# Altium schematic sheet SH10-ASSI.SchDoc
size A4
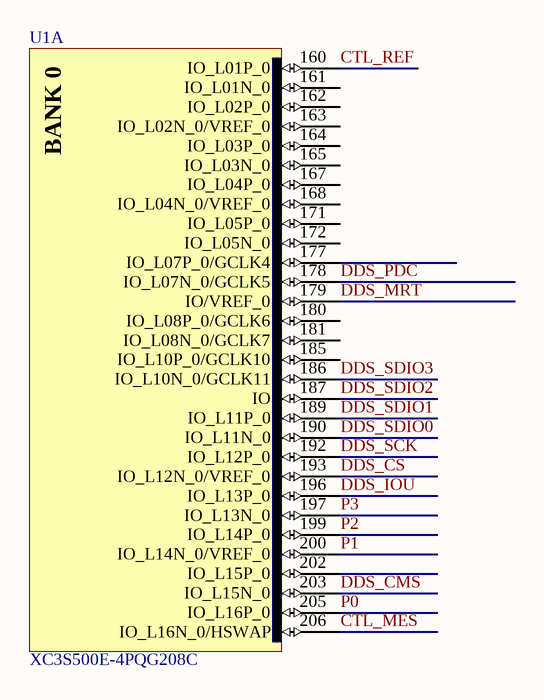
[diagram p0: SH10-ASSI.SchDoc]

## Parts
U1  XC3S500E-4PQG208C  [PQG208_N]  (part A of 8)

## Nets
CTL_MES: U1.206(IO_L16N_0/HSWAP)
CTL_REF: U1.160(IO_L01P_0)
DDS_~{CS}: U1.193(IO_L12N_0/VREF_0)
DDS_CMS: U1.203(IO_L15N_0)
DDS_IOU: U1.196(IO_L13P_0)
DDS_MRT: U1.179(IO/VREF_0)
DDS_PDC: U1.178(IO_L07N_0/GCLK5)
DDS_SCK: U1.192(IO_L12P_0)
DDS_SDIO0: U1.190(IO_L11N_0)
DDS_SDIO1: U1.189(IO_L11P_0)
DDS_SDIO2: U1.187(IO)
DDS_SDIO3: U1.186(IO_L10N_0/GCLK11)
P0: U1.205(IO_L16P_0)
P1: U1.200(IO_L14N_0/VREF_0)
P2: U1.199(IO_L14P_0)
P3: U1.197(IO_L13N_0)

Not connected (* = marked no-connect by the designer): U1 161(IO_L01N_0) 162(IO_L02P_0) 163(IO_L02N_0/VREF_0) 164(IO_L03P_0) 165(IO_L03N_0) 167(IO_L04P_0) 168(IO_L04N_0/VREF_0) 171(IO_L05P_0) 172(IO_L05N_0) 177(IO_L07P_0/GCLK4) 180(IO_L08P_0/GCLK6) 181(IO_L08N_0/GCLK7) 185(IO_L10P_0/GCLK10) 202(IO_L15P_0)

## Notes on the sheet
- (in symbol XC3S500E-4PQG208C, part A) BANK 0

## Library data of the parts
U1 = XC3S500E-4PQG208C: Spartan-3E 1.2V FPGA, 158 User I/Os, 208-Pin Pb-Free PQFP, Standard Performance, Commercial Grade; Published: 6-Jun-2005; LatestRevisionDate: 13-Apr-2006; LatestRevisionNote: IPC-7351 Footprint Added.; DatasheetVersion: 16-Mar-2007; PackageVersion: ver1.2, Jun-2004; PackageReference: PQG208; Publisher: Altium Limited; PackageDescription: 208-Pin Plastic Quad Flat Pack (PQG208) - Pb-Free; Code_JEDEC: MS-029-FA-1; ComponentLink1Description: Manufacturer Link; ComponentLink1URL: http://www.xilinx.com/products/silicon_solutions/fpgas/spartan_series/spartan3e_fpgas/index.htm; ComponentLink2Description: Datasheet; ComponentLink2URL: http://direct.xilinx.com/bvdocs/publications/ds312.pdf